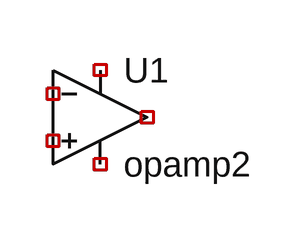
[diagram p0: schematic Draft1.asc]
Draft1.asc, the LTspice schematic file:
Version 4
SHEET 1 880 680
SYMBOL OpAmps\\opamp2 160 128 R0
SYMATTR InstName U1

The netlist it stands for:
* Draft1.asc
XU1 NC_01 NC_02 NC_03 NC_04 NC_05 opamp2  ; pins In+ In- V+ V- OUT
.backanno
.end